# Altium schematic sheet Schematic_Livestock control and monitoring system.schdoc
size 288 x 241 mm
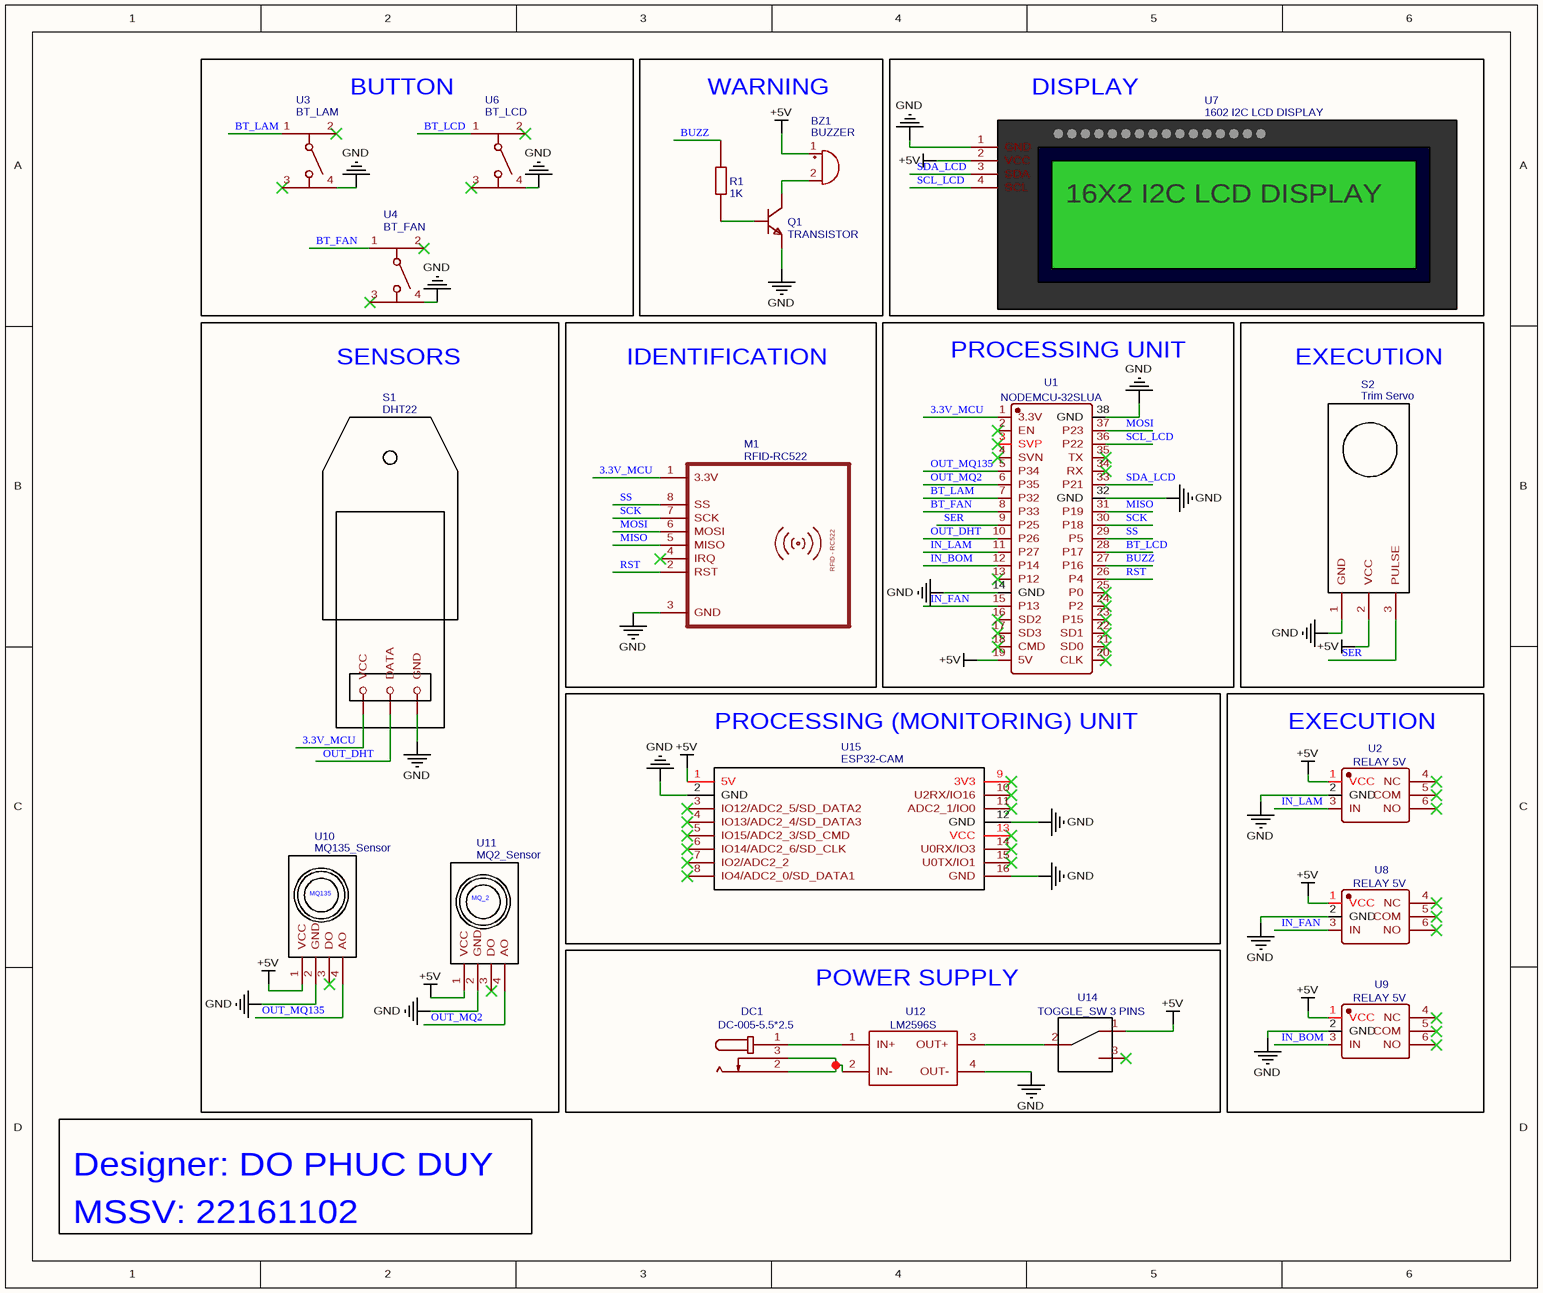
[diagram p0: Schematic_Livestock control and monitoring system.schdoc]

## Parts
BZ1  BUZZER  [BUZZER_BEEPER:BUZZER_12X9.5RM7.6]
DC1  DC-005-5.5*2.5  [DC-IN-TH_DC-005-2]
M1  RFID-RC522  [ARUN-RFID]
Q1  TRANSISTOR  [NPN-TRANSISTOR]
R1  1K  [AXIAL-1.5]
S1  DHT22  [DHT22]
S2  Trim Servo  [RC-SERVO-CONNECTOR]
U1  NODEMCU-32SLUA  [COMM-TH_NODEMCU-32SLUA]
U2  RELAY 5V  [RELAY MODULE LOW/HIGH - PCB]
U3  BT_LAM  [SW-TH_4P-L6.0-W6.0-P4.50-LS6.1]
U4  BT_FAN  [SW-TH_4P-L6.0-W6.0-P4.50-LS6.1]
U6  BT_LCD  [SW-TH_4P-L6.0-W6.0-P4.50-LS6.1]
U7  1602 I2C LCD DISPLAY  [I2C LCD FTPRNT]
U8  RELAY 5V  [RELAY MODULE LOW/HIGH - PCB]
U9  RELAY 5V  [RELAY MODULE LOW/HIGH - PCB]
U10  MQ135_Sensor  [MQ135_MODULO]
U11  MQ2_Sensor  [MQ135_MODULO]
U12  LM2596S  [LM2596:YAAJ_DCDC_STEPDOWN_LM2596]
U14  TOGGLE_SW 3 PINS  [TOGGLE SWITCH]
U15  ESP32-CAM  [ESP32-CAM]

## Blocks framed on the sheet
BUTTON: U3 U4 U6
WARNING: BZ1 Q1 R1
DISPLAY: U7
SENSORS: S1 U10 U11
IDENTIFICATION: M1
PROCESSING UNIT: U1
EXECUTION: S2
PROCESSING (MONITORING) UNIT: U15
EXECUTION: U2 U8 U9
POWER SUPPLY: DC1 U12 U14

## Nets
+5V: BZ1.1(+) S2.2(VCC) U1.19(5V) U2.1(VCC) U7.2(VCC) U8.1(VCC) U9.1(VCC) U10.1(VCC) U11.1(VCC) U14.1 U15.1(5V)
GND: M1.3(GND) Q1.1(E) S1.3(GND) S2.1(GND) U1.14(GND) U1.32(GND) U1.38(GND) U2.2(GND) U3.4 U4.4 U6.4 U7.1(GND) U8.2(GND) U9.2(GND) U10.2(GND) U11.2(GND) U12.4(OUT-) U15.2(GND) U15.12(GND) U15.16(GND)
3.3V_MCU: M1.1(3.3V) S1.1(VCC) U1.1(3.3V)
BT_FAN: U1.8(P33) U4.1
BT_LAM: U1.7(P32) U3.1
BT_LCD: U1.28(P17) U6.1
BUZZ: R1.2 U1.27(P16)
IN_BOM: U1.12(P14) U9.3(IN)
IN_FAN: U1.15(P13) U8.3(IN)
IN_LAM: U1.11(P27) U2.3(IN)
MISO: M1.5(MISO) U1.31(P19)
MOSI: M1.6(MOSI) U1.37(P23)
OUT_DHT: S1.2(DATA) U1.10(P26)
OUT_MQ2: U1.6(P35) U11.4(AO)
OUT_MQ135: U1.5(P34) U10.4(AO)
RST: M1.2(RST) U1.26(P4)
SCK: M1.7(SCK) U1.30(P18)
SCL_LCD: U1.36(P22) U7.4(SCL)
SDA_LCD: U1.33(P21) U7.3(SDA)
SER: S2.3(PULSE) U1.9(P25)
SS: M1.8(SS) U1.29(P5)
NetBZ1_2: BZ1.2(-) Q1.3(C)
NetDC1_1: DC1.1 U12.1(IN+)
NetDC1_2: DC1.2 DC1.3 U12.2(IN-)
NetQ1_2: Q1.2(B) R1.1
NetU12_3: U12.3(OUT+) U14.2

Not connected (* = marked no-connect by the designer): M1 4(IRQ)*; U1 2(EN)* 3(SVP)* 4(SVN)* 13(P12)* 16(SD2)* 17(SD3)* 18(CMD)* 20(CLK)* 21(SD0)* 22(SD1)* 23(P15)* 24(P2)* 25(P0)* 34(RX)* 35(TX)*; U2 4(NC)* 5(COM)* 6(NO)*; U3 2* 3*; U4 2* 3*; U6 2* 3*; U8 4(NC)* 5(COM)* 6(NO)*; U9 4(NC)* 5(COM)* 6(NO)*; U10 3(DO)*; U11 3(DO)*; U14 3*; U15 3(IO12/ADC2_5/SD_DATA2)* 4(IO13/ADC2_4/SD_DATA3)* 5(IO15/ADC2_3/SD_CMD)* 6(IO14/ADC2_6/SD_CLK)* 7(IO2/ADC2_2)* 8(IO4/ADC2_0/SD_DATA1)* 9(3V3)* 10(U2RX/IO16)* 11(ADC2_1/IO0)* 13(VCC)* 14(U0RX/IO3)* 15(U0TX/IO1)*

## Notes on the sheet
- Designer: DO PHUC DUY
- MSSV: 22161102
- (in symbol 1602 I2C LCD DISPLAY) 16X2 I2C LCD DISPLAY
- (in symbol MQ2_Sensor) MQ_2
- (in symbol MQ135_Sensor) MQ135
- (in symbol RFID-RC522) RFID - RC522

## Library data of the parts
BZ1 = BUZZER: Symbol: Device_Buzzer; Add into BOM: yes; Contributor: xuantan27012003; Device: Device_Buzzer; User doc link: ~; Convert to PCB: yes; Origin Footprint: Buzzer_Beeper:Buzzer_12x9.5RM7.6; spicePre: B; spiceSymbolName: Device_Buzzer
DC1 = DC-005-5.5*2.5: Manufacturer: null; Contributor: lcsc; Supplier: LCSC; Supplier Part: C9900017043; Manufacturer Part: DC-005-5.5*2.5; JLCPCB Part Class: Extended Part; spicePre: D; spiceSymbolName: DC-005-5.5*2.5
M1 = RFID-RC522: Contributor: manthan_0182; description: RFID-RC522; spicePre: M; spiceSymbolName: RFID-RC522_ARUN COPY
Q1 = TRANSISTOR: Manufacturer: SEMTECH; Manufacturer Part: 2N4401; Contributor: ali.sivananda; Supplier Part: C118540; JLCPCB Part Class: Extended Part; spicePre: Q; spiceSymbolName: TRANSISTOR_ALI
R1 = 1K: Manufacturer: Multicomp; Manufacturer Part: MOR01SJ0101A10; nameAlias: Value; Contributor: Isuru Sandaruwan; Supplier: Farnell; Supplier Part: 1357879; spicePre: R; spiceSymbolName: Resistor for Asignment(long)
S1 = DHT22: Contributor: Muhammad Taufiq; spicePre: S; spiceSymbolName: DHT22
S2 = Trim Servo: Contributor: Sunil Sinsinwar; spicePre: U; spiceSymbolName: RC-Servo-Connector
U1 = NODEMCU-32SLUA: Manufacturer: Ai-Thinker(安信可); Contributor: lcsc; Supplier: LCSC; Supplier Part: C111436; Manufacturer Part: NodeMCU-32SLua; JLCPCB Part Class: Extended Part; spicePre: U; spiceSymbolName: NODEMCU-32SLUA
U2 U8 U9 = RELAY 5V: Manufacturer: China; Manufacturer Part: Monday Kids; Contributor: dophucduy3; link: https://www.mondaykids.com/monday-kids-1-channel-relay-module-with-optocoupler-isolation-support-high-and-low-level-trigger-5v.html; spicePre: U; spiceSymbolName: VN-5V 1 CHANNEL RELAY H/L OPTO COPY COPY
U3 = BT_LAM: Manufacturer: BBJ; Manufacturer Part: Switch,6*6*6Plastic head,260G, 0.25mm,Straight line; Supplier Part: C71836; Supplier: LCSC; spicePre: S; spiceSymbolName: Button-6x6x6mm
U4 = BT_FAN: Manufacturer: BBJ; Manufacturer Part: Switch,6*6*6Plastic head,260G, 0.25mm,Straight line; Supplier Part: C71836; Supplier: LCSC; spicePre: S; spiceSymbolName: Button-6x6x6mm
U6 = BT_LCD: Manufacturer: BBJ; Manufacturer Part: Switch,6*6*6Plastic head,260G, 0.25mm,Straight line; Supplier Part: C71836; Supplier: LCSC; spicePre: S; spiceSymbolName: Button-6x6x6mm
U7 = 1602 I2C LCD DISPLAY: Contributor: dophucduy3; spicePre: U; spiceSymbolName: 1602 I2C LCD DISPLAY
U10 = MQ135_Sensor: Contributor: rusiru5707; spicePre: U; spiceSymbolName: SCHLIB_MQ135_Sensor_2022-02-27
U11 = MQ2_Sensor: Contributor: rusiru5707; spicePre: U; spiceSymbolName: SCHLIB_MQ135_Sensor_2022-02-27
U12 = LM2596S: Symbol: BuckConverters_LM2596_Adj; Description: Servo 5V; Add into BOM: yes; Origin Footprint: YAAJ_DCDC_StepDown_LM2596; Contributor: mannymoy86; Device: BuckConverters_LM2596_Adj; Convert to PCB: yes; spicePre: U; spiceSymbolName: BuckConverters_LM2596_Adj; Supplier: TME
U14 = TOGGLE_SW 3 PINS: Contributor: cesaro.patafisico; spicePre: U; spiceSymbolName: TOGGLE SWITCH 3 PINS
U15 = ESP32-CAM: Contributor: dophucduy3; spicePre: U; spiceSymbolName: ESP32-CAM